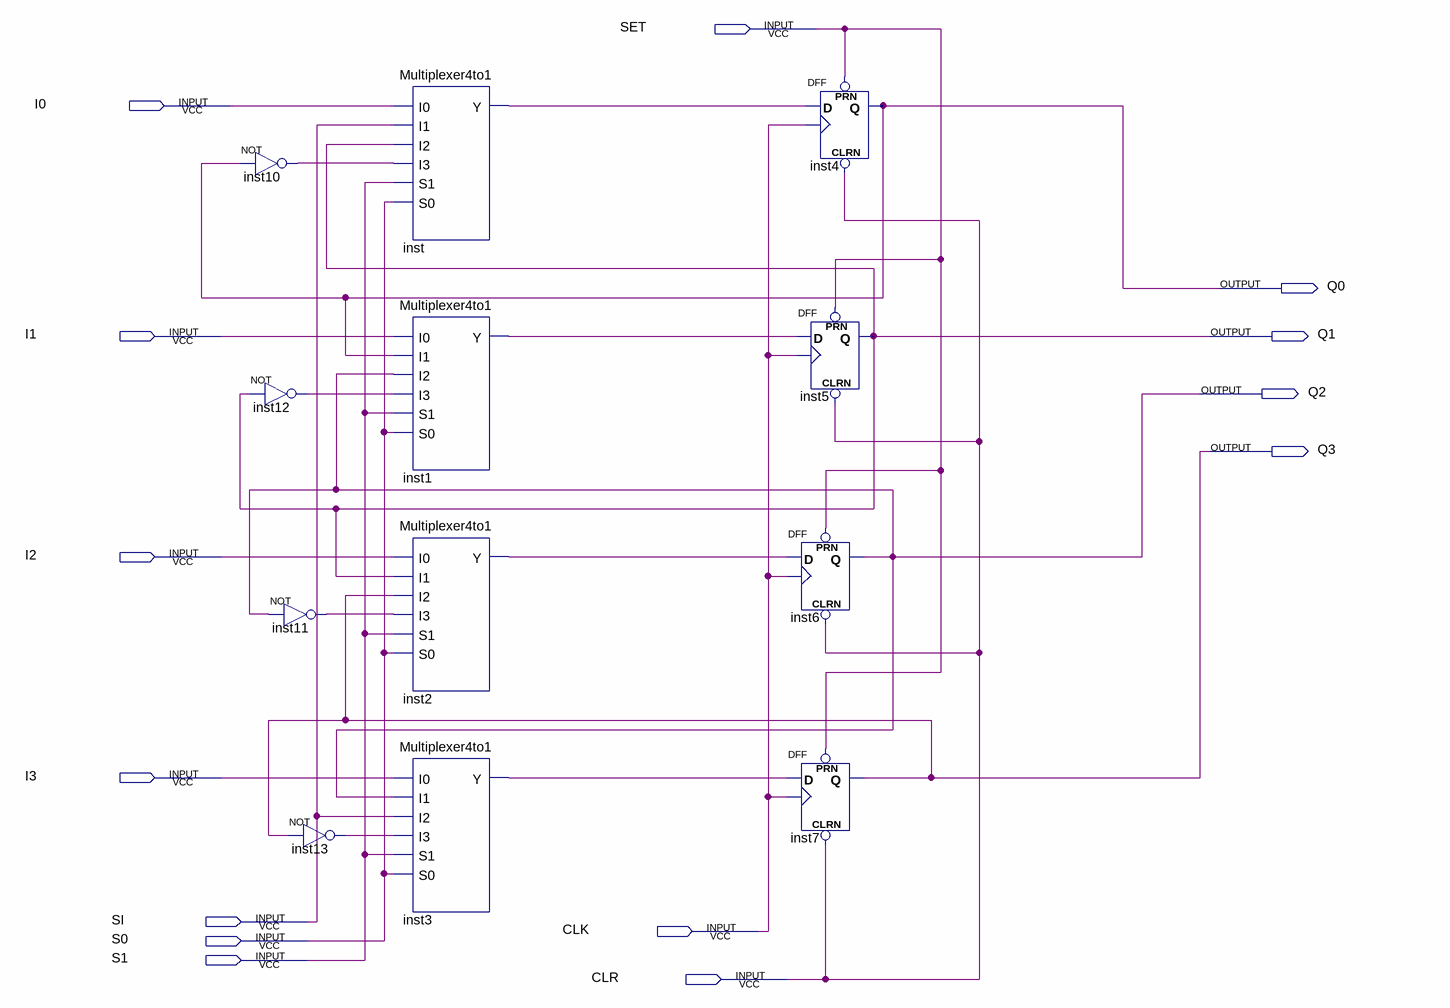
[diagram p0: schematic sheet]
// Quartus schematic Register.bdf as structural Verilog: 12 symbols, 14 pins
module Register (
  input  SET,
  input  I0,
  input  I1,
  input  I2,
  input  I3,
  input  SI,
  input  CLK,
  input  S0,
  input  S1,
  input  CLR,
  output Q0,
  output Q1,
  output Q2,
  output Q3
);

  wire inst1_y, inst2_y, inst3_y, inst10_out, inst11_out, inst12_out, inst13_out, inst_y;

  not inst10 (inst10_out, Q0);
  not inst12 (inst12_out, Q1);
  not inst11 (inst11_out, Q2);
  not inst13 (inst13_out, Q3);
  Multiplexer4to1 inst (.I0(I0), .I1(SI), .I2(Q1), .I3(inst10_out), .S1(S1), .S0(S0), .Y(inst_y));
  Multiplexer4to1 inst1 (.I0(I1), .I1(Q0), .I2(Q2), .I3(inst12_out), .S1(S1), .S0(S0), .Y(inst1_y));
  Multiplexer4to1 inst2 (.I0(I2), .I1(Q1), .I2(Q3), .I3(inst11_out), .S1(S1), .S0(S0), .Y(inst2_y));
  Multiplexer4to1 inst3 (.I0(I3), .I1(Q2), .I2(SI), .I3(inst13_out), .S1(S1), .S0(S0), .Y(inst3_y));
  DFF inst4 (.CLRN(CLR), .CLK(CLK), .D(inst_y), .PRN(SET), .Q(Q0));
  DFF inst5 (.CLRN(CLR), .CLK(CLK), .D(inst1_y), .PRN(SET), .Q(Q1));
  DFF inst6 (.CLRN(CLR), .CLK(CLK), .D(inst2_y), .PRN(SET), .Q(Q2));
  DFF inst7 (.CLRN(CLR), .CLK(CLK), .D(inst3_y), .PRN(SET), .Q(Q3));
endmodule
